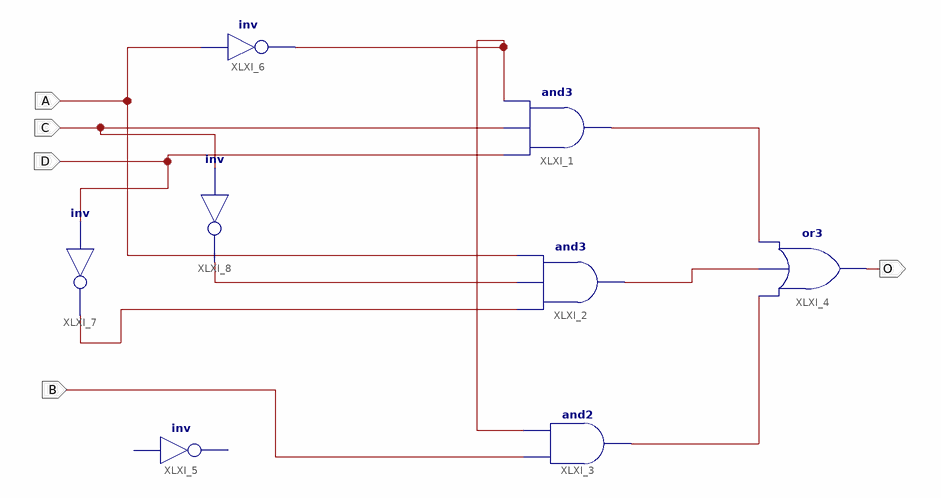
[diagram p0: schematic sheet 1]
// Xilinx ISE schematic lab7_A2.sch (spartan3e) as structural Verilog: 8 symbols, 5 ports
module lab7_A2 (
  input  C,
  input  D,
  input  B,
  input  A,
  output O
);

  wire XLXN_7, XLXN_12, XLXN_14, XLXN_15, XLXN_16, XLXN_17;

  and XLXI_1 (XLXN_16, C, XLXN_7);  // open: I0
  and XLXI_2 (XLXN_15, XLXN_12, XLXN_14, A);
  and XLXI_3 (XLXN_17, B, XLXN_7);
  or XLXI_4 (O, XLXN_17, XLXN_15, XLXN_16);
  // inv XLXI_5 is placed but not wired
  not XLXI_6 (XLXN_7, A);
  not XLXI_7 (XLXN_12, D);
  not XLXI_8 (XLXN_14, C);
endmodule
